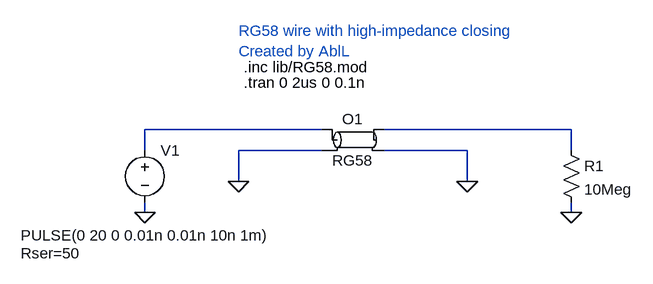
[diagram p0: schematic Leitungstheorie-RG58.asc]
Leitungstheorie-RG58.asc, the LTspice schematic file:
Version 4
SHEET 1 880 680
WIRE 128 112 -144 112
WIRE 512 112 224 112
WIRE -144 144 -144 112
WIRE 128 144 0 144
WIRE 352 144 224 144
WIRE 512 144 512 112
WIRE 0 192 0 144
WIRE 352 192 352 144
WIRE -144 240 -144 224
WIRE 512 240 512 224
FLAG 0 192 0
FLAG 352 192 0
FLAG 512 240 0
FLAG -144 240 0
SYMBOL res 496 128 R0
SYMATTR InstName R1
SYMATTR Value 10Meg
SYMBOL voltage -144 128 R0
WINDOW 3 -191 147 Left 2
WINDOW 123 0 0 Left 0
WINDOW 39 -191 175 Left 2
SYMATTR Value PULSE(0 20 0 0.01n 0.01n 10n 1m)
SYMATTR SpiceLine Rser=50
SYMATTR InstName V1
SYMBOL ltline 176 128 R0
SYMATTR InstName O1
SYMATTR Value RG58
TEXT 8 40 Left 2 !.tran 0 2us 0 0.1n
TEXT 8 16 Left 2 !.inc lib/RG58.mod
TEXT 0 -40 Left 2 ;RG58 wire with high-impedance closing\nCreated by AblL

The netlist it stands for:
* Leitungstheorie-RG58.asc
R1 N002 0 10Meg
V1 N001 0 PULSE(0 20 0 0.01n 0.01n 10n 1m) Rser=50
O1 N001 0 N002 0 RG58
.tran 0 2us 0 0.1n
.inc lib/RG58.mod
* RG58 wire with high-impedance closing
* Created by AblL
.backanno
.end